# EAGLE schematic Spice Simulation (EAGLE 9.6.2)
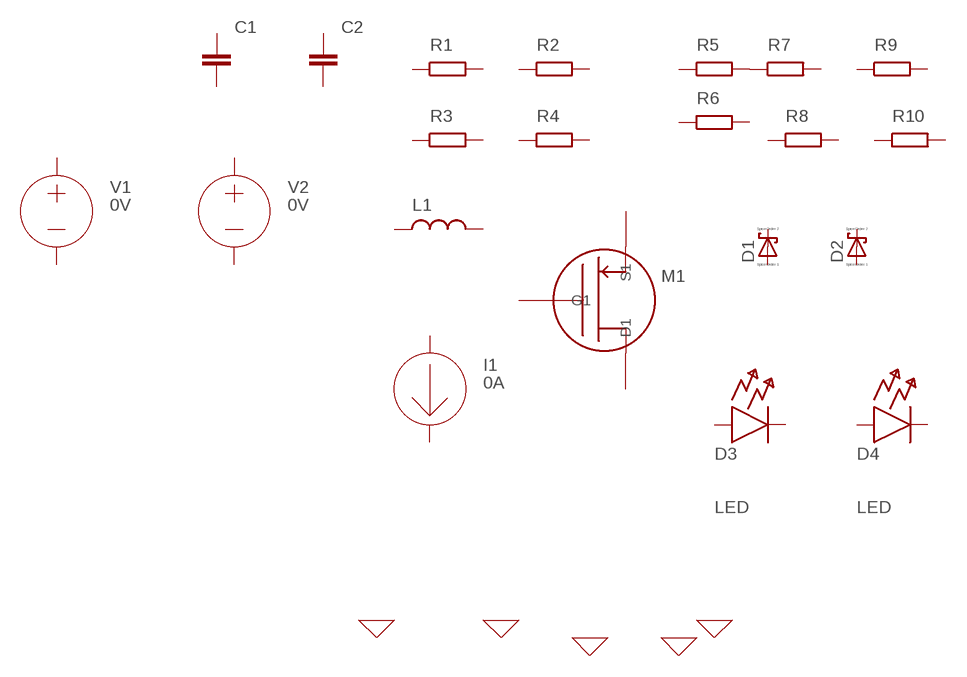
[diagram p0: schematic, sheet 1]

## Parts
C1  C  (no package)
C2  C  (no package)
D1  SCHOTTKY-DIODE  [DIODE_SMB]
D2  SCHOTTKY-DIODE  [DIODE_SMB]
D3  LED  (no package)
D4  LED  (no package)
I1  0A  CURRENT  (no package)
L1  L  (no package)
M1  FET_P  (no package)
R1  R  (no package)
R2  R  (no package)
R3  R  (no package)
R4  R  (no package)
R5  R  (no package)
R6  R  (no package)
R7  R  (no package)
R8  R  (no package)
R9  R  (no package)
R10  R  (no package)
V1  0V  VOLTAGE  (no package)
V2  0V  VOLTAGE  (no package)

## Nets
N$1: R5.2 R7.1
Unconnected: C1.1 C1.2 C2.1 C2.2 D1.A(C) D1.C(A) D2.A(C) D2.C(A) D3.A D3.C D4.A D4.C I1.+ I1.- L1.1 L1.2 M1.D1 M1.G1 M1.S1 R1.1 R1.2 R2.1 R2.2 R3.1 R3.2 R4.1 R4.2 R5.1 R6.1 R6.2 R7.2 R8.1 R8.2 R9.1 R9.2 R10.1 R10.2 V1.+ V1.- V2.+ V2.-

## Library data of the parts
C1 C2 = ngspice-simulation:C: CAPACITOR
D1 D2 = eagle-ltspice:SCHOTTKY-DIODE: Schottky Diode; SPICEMODEL: NONE; SPICEPREFIX: D; SPICETYPE: diode
D3 D4 = ngspice-simulation:LED: Diode
I1 = ngspice-simulation:CURRENT: Independent Current Source
L1 = ngspice-simulation:L: INDUCTOR
M1 = ngspice-simulation:FET_P: P-Type MOS Field Effect Transistor (MOSFET)
R1-R10 = ngspice-simulation:R: RESISTOR
V1 V2 = ngspice-simulation:VOLTAGE: Independent Voltage Source, either DC, AC, PULSE, SINE, PWL, EXP, or SFFM